# Altium schematic sheet EMG_Sensors_Temp.SchDoc
size 431 x 279 mm; SheetNumber: 1; SheetTotal: 1; ENG_APP_DATE: --/--/--; DSN_APP_DATE: --/--/--; CHK_APP_DATE: --/--/--
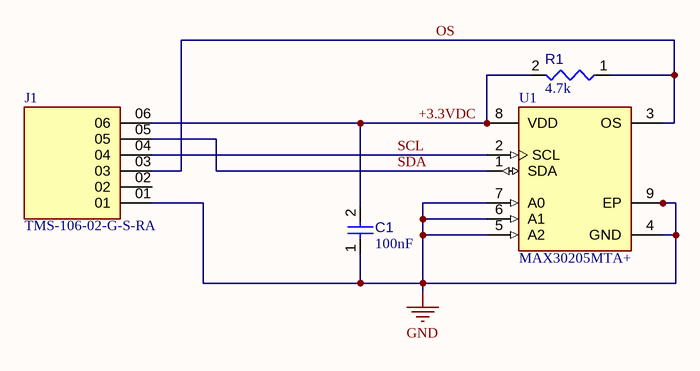
[diagram p0: EMG_Sensors_Temp.SchDoc]

## Parts
C1  value 100nF  [CAPC1005X56X25LL10T15]  (hidden comment: Capacitor 0.1 uF +/- 5% 16 V 0402)
J1  TMS-106-02-G-S-RA  [SAMTEC_TMS-106-02-G-S-RA]
R1  value 4.7k  [RESC1005X40X25ML05T05]  (hidden comment: Resistor 4k7 +/-1% 0402 63 mW)
U1  MAX30205MTA+  [FP-T833-2-MFG]

## Nets
GND: C1.1 J1.01 U1.4(GND) U1.5(A2) U1.6(A1) U1.7(A0) U1.9(EP)
+3.3VDC: C1.2 J1.06 R1.2 U1.8(VDD)
OS: J1.03 R1.1 U1.3(OS)
SCL: J1.04 U1.2(SCL)
SDA: J1.05 U1.1(SDA)

Not connected (* = marked no-connect by the designer): J1 02

## Notes on the sheet
- DWG. NO.
- REV.
- SHT.
- THIS DOCUMENT AND THE DATA DISCLOSED HEREIN OR HEREWITH IS THE PROPERTY OF ALTIUM LIMITED AND MAY BE FREELY DISTRIBUTED IN WHOLE. NO RIGHTS ARE RESERVED OR EXPRESS OR IMPLIED WARANTEE GIVEN.
- REVISION
- DESCRIPTION
- DATE
- APPROVED
- ENG:
- APPROVALS
- PROJECT
- DSN:
- CHK:
- REFERENCE DOCUMENTS
- PROJECT REVISION:
- TITLE
- DOCUMENT REVISION:
- DESIGN ITEM:
- BOM:
- FAB DWG:
- PCB DWG:
- ASSY DWG:
- SCALE:
- SIZE
- B
- CAGE CODE
- FILE NAME
- DWG NO.
- SHEET
- OF
- REV

## Library data of the parts
C1 = CMP-001-00001-6: Chip Capacitor, 0.1 uF, +/- 5%, 16 V, 0402 (1005 Metric); Capacitor Type: Ceramic; Voltage Rating: 16V; Max Operating Temperature: 125°C; Min Operating Temperature: -55°C; Case/Package: 0402; Mounting Technology: SM; Pins: 2; Tolerance: 5%; RoHS Compliant: True
R1 = CMP-009-00034-5: Chip Resistor, 4.7 KOhm, +/- 1%, 63 mW, -55 to 155 degC, 0402 (1005 Metric); Power: 63mW; Voltage Rating: 50V; Case/Package: 0402; Tolerance: 1%; Max Operating Temperature: 155°C; Pins: 2; RoHS Compliant: True; Min Operating Temperature: -55°C; Mounting Technology: SM
U1 = CMP-05752-000001-1: SENSOR DIGITAL 0C-50C 8TDFN; Manufacturer: Maxim Integrated; Interface: I2C,2-Wire,SMBus; Max Junction Temp: +50°C; Operating Supply Current: 600uA; Resolution: 16bits; Max Supply Voltage: 3.3V; Standoff Height: 0mm; Min Supply Voltage: 2.7V; Sensor Output: I2C; Manufacturer Part Number: MAX30205MTA+; Automotive: No; Device Class L1: Sensors; Temperature: 0°C to +50°C; Height: 0.8mm; ComponentLink2Description: Datasheet; Lead Free: Yes; Package: T833-2; Temperature Range Low: 0°C; Ipc Land Pattern Name: DFN300X300X75-8; Category: IC; Octopart: https://octopart.com/max30205mta%2B-maxim+integrated-66461181; ComponentLink2URL: https://datasheets.maximintegrated.com/en/ds/MAX30205.pdf; Digikey Description: SENSOR DIGITAL 0C-50C 8TDFN; Device Class L3: unset; Device Class L2: Temperature and Humidity Sensors; Temperature Range High: +50°C; RoHS: TRUE; Footprint Url: https://pdfserv.maximintegrated.com/land_patterns/90-0059.PDF
J1 = TMS-106-02-G-S-RA: Package: None; Price: None; Value: *; MP: TMS-106-02-G-S-RA; Availability: Unavailable